# Altium project _OV2640 24-pin Pinout.PrjPCB
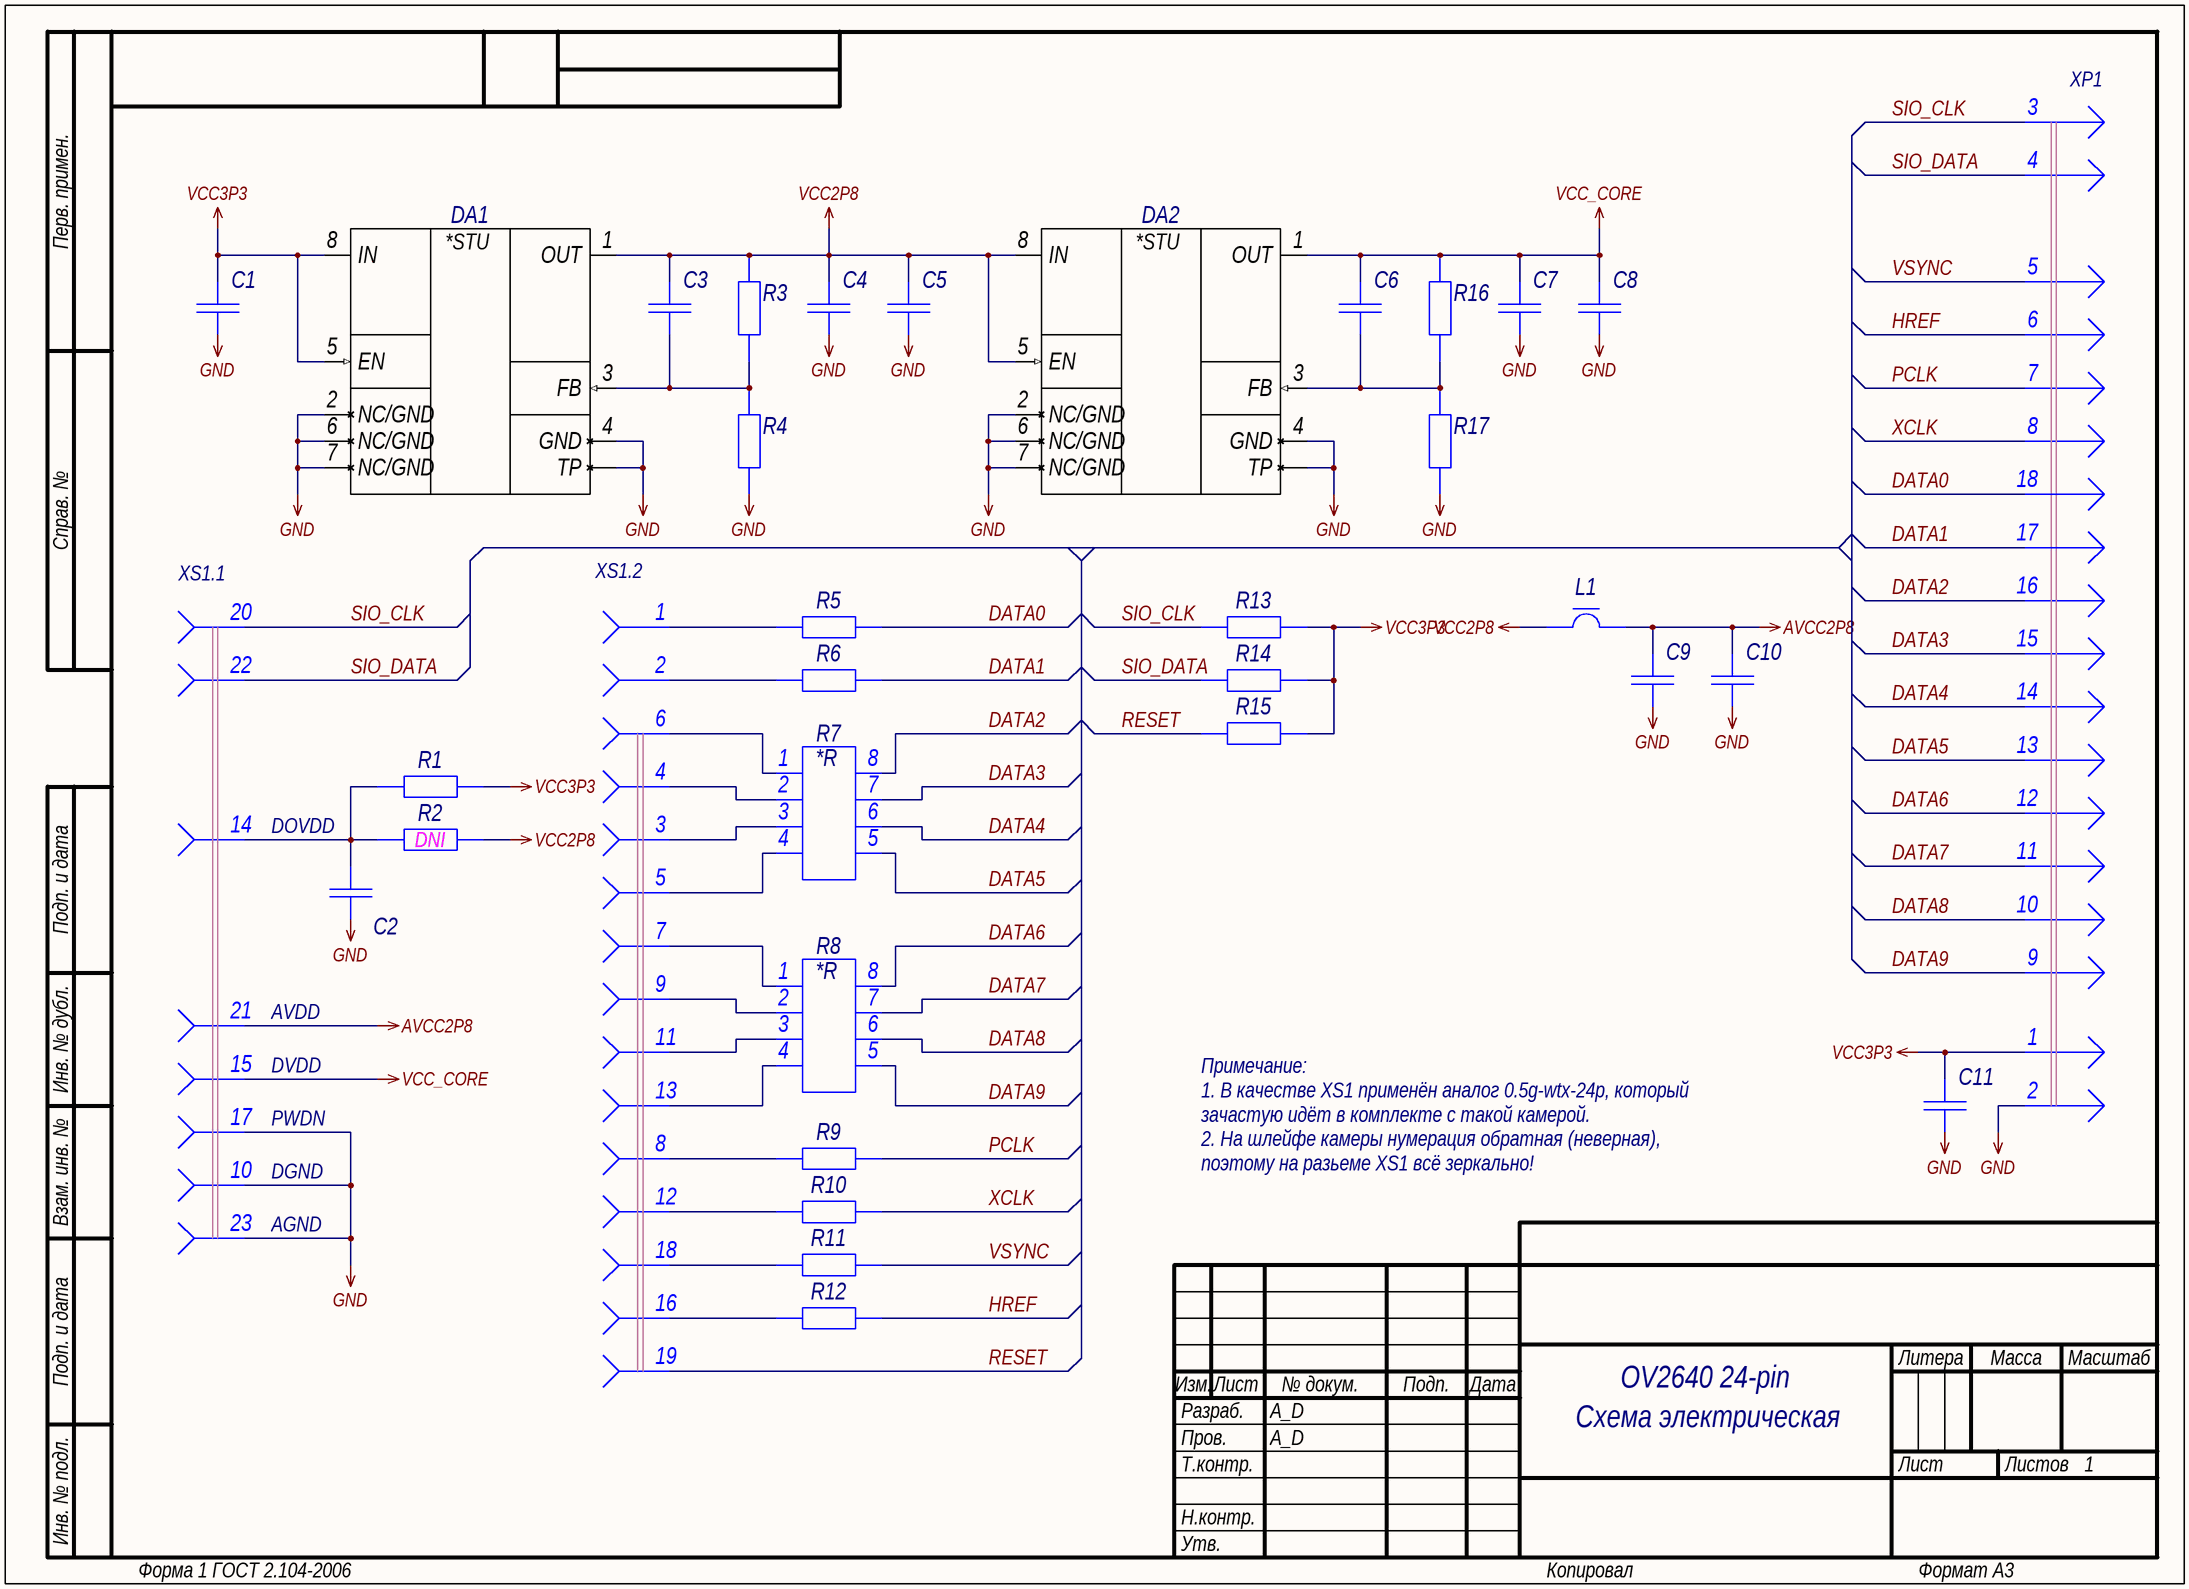
[diagram p0: 01_MAIN.SchDoc]
GlobalProjectRevision: 0; GlobalProjectNumber: A_D.000000.001; GlobalProjectName: OV2640 24-pin; GlobalOrganizationName: A_D Electronics
1 sheet, 33 parts. Net scope: global (net labels, ports and power ports of the same name join across sheets).
Board file: BOARD.PcbDoc

## Sheet 01_MAIN.SchDoc: =GlobalProjectName
size 410 x 297 mm; CheckedBy: A_D; Author: A_D; Organization: A_D Electronics; DocumentNumber: A_D.000000.001 Э3; Revision: 0; SheetTotal: 1; PageSetup: Record=PageOptions|CenterHorizontal=True|CenterVertical=True|PrintScale=0.70|XCorrection=1.00|YCorrection=1.00|PrintKind=2|BorderSize=5000000|LeftOffset=9000|BottomOffset=10100|Orientation=2|PaperLength=11176|PaperWidth=8636|Scale=100|PaperSource=259|PrintQuality=-3|MediaType=1|DitherType=10|PrintScaleMode=1|PaperKind=A3|PaperIndex=8; FirstApplication: A_D.000000.001; DocumentName: OV2640 24-pin

### Parts
C1  Capacitor  [C0603_160X080H080_H]  (value not drawn)
C2  Capacitor  [C0603_160X080H080_H]  (value not drawn)
C3  Capacitor  [C0603_160X080H080_H]  (value not drawn)
C4  Capacitor  [C0603_160X080H080_H]  (value not drawn)
C5  Capacitor  [C0603_160X080H080_H]  (value not drawn)
C6  Capacitor  [C0603_160X080H080_H]  (value not drawn)
C7  Capacitor  [C0603_160X080H080_H]  (value not drawn)
C8  Capacitor  [C0603_160X080H080_H]  (value not drawn)
C9  Capacitor  [C0603_160X080H080_H]  (value not drawn)
C10  Capacitor  [C0603_160X080H080_H]  (value not drawn)
C11  Capacitor  [C0603_160X080H080_H]  (value not drawn)
DA1  TPS73501DRB  [VSON-8_065P300X300X100_N]  (value not drawn)
DA2  TPS73501DRB  [VSON-8_065P300X300X100_N]  (value not drawn)
L1  FerriteBead  [L0603_160X080H080_H]  (value not drawn)
R1  Resistor  [R0603_160X080H045_H]  (value not drawn)
R2  Resistor  [R0603_160X080H045_H]  (value not drawn)  (no BOM)
R3  Resistor  [R0603_160X080H045_H]  (value not drawn)
R4  Resistor  [R0603_160X080H045_H]  (value not drawn)
R5  Resistor  [R0603_160X080H045_H]  (value not drawn)
R6  Resistor  [R0603_160X080H045_H]  (value not drawn)
R7  Resistor-4  [CAT16-x4]  (value not drawn)
R8  Resistor-4  [CAT16-x4]  (value not drawn)
R9  Resistor  [R0603_160X080H045_H]  (value not drawn)
R10  Resistor  [R0603_160X080H045_H]  (value not drawn)
R11  Resistor  [R0603_160X080H045_H]  (value not drawn)
R12  Resistor  [R0603_160X080H045_H]  (value not drawn)
R13  Resistor  [R0603_160X080H045_H]  (value not drawn)
R14  Resistor  [R0603_160X080H045_H]  (value not drawn)
R15  Resistor  [R0603_160X080H045_H]  (value not drawn)
R16  Resistor  [R0603_160X080H045_H]  (value not drawn)
R17  Resistor  [R0603_160X080H045_H]  (value not drawn)
XP1  Text  [PLD-18]  (value not drawn)  (parts A,B,C,D,E,F,G,H,I,J,K,L,M,N,O,P,Q,R of 18)
XS1  OV7670  [FH12-24S-0.5SH]  (value not drawn)  (parts A,B,C,D,E,F,G,H,I,J,K,L,M,N,O,P,Q,R,S,T,U,V,W of 24)

### Nets
AVCC2P8: C9.2 C10.2 L1.2 XS1.21
GND: C1.1 C2.1 C4.1 C5.1 C7.1 C8.1 C9.1 C10.1 C11.1 DA1.2(NC/GND) DA1.4(GND) DA1.6(NC/GND) DA1.7(NC/GND) DA1.TP DA2.2(NC/GND) DA2.4(GND) DA2.6(NC/GND) DA2.7(NC/GND) DA2.TP R4.1 R17.1 XP1.2 XS1.10 XS1.17 XS1.23
VCC2P8: C3.2 C4.2 C5.2 DA1.1(OUT) DA2.5(EN) DA2.8(IN) L1.1 R2.2 R3.1
VCC3P3: C1.2 C11.2 DA1.5(EN) DA1.8(IN) R1.2 R13.2 R14.2 R15.2 XP1.1
VCC_CORE: C6.2 C7.2 C8.2 DA2.1(OUT) R16.2 XS1.15
DATA0: R5.2 XP1.18
DATA1: R6.2 XP1.17
DATA2: R7.8 XP1.16
DATA3: R7.7 XP1.15
DATA4: R7.6 XP1.14
DATA5: R7.5 XP1.13
DATA6: R8.8 XP1.12
DATA7: R8.7 XP1.11
DATA8: R8.6 XP1.10
DATA9: R8.5 XP1.9
HREF: R12.2 XP1.6
PCLK: R9.2 XP1.7
RESET: R15.1 XS1.19
SIO_CLK: R13.1 XP1.3 XS1.20
SIO_DATA: R14.1 XP1.4 XS1.22
VSYNC: R11.2 XP1.5
XCLK: R10.2 XP1.8
NetC2_2: C2.2 R1.1 R2.1 XS1.14
NetC3_1: C3.1 DA1.3(FB) R3.2 R4.2
NetC6_1: C6.1 DA2.3(FB) R16.1 R17.2
NetR5_1: R5.1 XS1.1
NetR6_1: R6.1 XS1.2
NetR7_1: R7.1 XS1.6
NetR7_2: R7.2 XS1.4
NetR7_3: R7.3 XS1.3
NetR7_4: R7.4 XS1.5
NetR8_1: R8.1 XS1.7
NetR8_2: R8.2 XS1.9
NetR8_3: R8.3 XS1.11
NetR8_4: R8.4 XS1.13
NetR9_1: R9.1 XS1.8
NetR10_1: R10.1 XS1.12
NetR11_1: R11.1 XS1.18
NetR12_1: R12.1 XS1.16

### Notes on the sheet
- (near XP1) XP1
- (near XS1) XS1.1
- (near XS1) XS1.2
- DOVDD
- (near R2) DNI
- (near XS1) AVDD
- (near XS1) PWDN
- (near XS1) DVDD
- (near XS1) DGND
- Примечание:
  1. В качестве XS1 применён аналог 0.5g-wtx-24p, который зачастую идёт в комплекте с такой камерой.
  2. На шлейфе камеры нумерация обратная (неверная), поэтому на разьеме XS1 всё зеркально!
- (near XS1) AGND
- Схема электрическая
  принципиальная
- Перв. примен.
- Справ. №
- Подп. и дата
- Инв. № дубл.
- Взам. инв. №
- Разраб.
- Изм.
- Лист
- № докум.
- Подп.
- Дата
- Литера
- Масса
- Масштаб
- Пров.
- Т.контр.
- Листов
- Инв. № подл.
- Н.контр.
- Утв.
- Форма 1 ГОСТ 2.104-2006
- Копировал
- Формат А3
- (in symbol CAT16-510J4LF) *R
- (in symbol TPS73501DRBR) *STU
- (in symbol TC164-JR-0751RL) *R

### Library data of the parts
C1 C2 C5 C9 = GCM188R71E105KA64D: Manufacturer: Murata; Type: Конденсатор; ID: 134; Value: 1uF; Voltage: 25V; Tolerance: ±10%; Dielectric Type: X7R; Application Category: 1; Working Temperature Min: -55°С; Working Temperature Max: +125°С; Functional Analog: GCM188R71E105KA64J; Schematic Value: 1uF, 25V, X7R; Published: 18.05.2010; Publisher: Andrew Danich; Part Number: GCM188R71E105KA64D; Footprint: 0603
C3 C6 = GRM1885C1H270JA01D: Manufacturer: Murata; Type: Конденсатор; ID: 213; Value: 27pF; Voltage: 50V; Tolerance: ±5%; Dielectric Type: NP0; Application Category: 1; Working Temperature Min: -55°С; Working Temperature Max: +125°С; Functional Analog: GRM1885C1H270JA01J; Schematic Value: 27pF, 50V, NP0; Published: 18.05.2010; Publisher: Andrew Danich; Part Number: GRM1885C1H270JA01D; Footprint: 0603
C4 C7 C11 = GRM188R60J106ME47D: Manufacturer: Murata; Type: Конденсатор; ID: 136; Value: 10uF; Voltage: 6.3V; Tolerance: ±20%; Dielectric Type: X5R; Application Category: 1; Working Temperature Min: -55°С; Working Temperature Max: +85°С; Functional Analog: GRM188R60J106ME47J; Schematic Value: 10uF, 6.3V, X5R; Published: 18.05.2010; Publisher: Andrew Danich; Part Number: GRM188R60J106ME47D; Footprint: 0603
C8 C10 = GRM188R72A104KA35D: Manufacturer: Murata; Type: Конденсатор; ID: 232; Value: 0.1uF; Voltage: 100V; Tolerance: ±10%; Dielectric Type: X7R; Application Category: 1; Working Temperature Min: -55°С; Working Temperature Max: +125°С; Functional Analog: GRM188R72A104KA35J; Schematic Value: 0.1uF, 100V, X7R; Published: 18.05.2010; Publisher: Andrew Danich; Part Number: GRM188R72A104KA35D; Footprint: 0603
DA1 DA2 = TPS73501DRBR: Manufacturer: Texas Instruments; ID: 27; Input Voltage: +2.2…5.5V; Output Current: 500mA; Output Voltage: +1.2…5.5V; RMS Noise: 13.2uV; Application Category: 1; Working Temperature Min: -40°С; Working Temperature Max: +125°С; Functional Analog: TPS73501DRBT; Published: 25.03.2019; Publisher: Andrew Danich; Type: Микросхема; Part Number: TPS73501DRBR; Value: TPS73501DRBR; ClassName: DirectConnect
L1 = BLM18PG221SH1D: Manufacturer: Murata; Type: Дроссель; ID: 8; Rated Current: 1.4A; Impedance at 100Mhz: 220ohm; Tolerance: ±25%; DC Resistance: 0.1ohm; Inductor Type: EMIFIL; Application Category: 1; Working Temperature Min: -55°С; Working Temperature Max: +125°С; Schematic Value: 220ohm ±25%; Functional Analog: BLM18PG221SH1B; Published: 14.11.2014; Publisher: Andrew Danich; Part Number: BLM18PG221SH1D; Value: BLM18PG221SH1D; Footprint: 0603
R1 R2 = RC0603JR-070R: Manufacturer: Yageo; ID: 5; Value: 0; Limit Voltage: 50V; Tolerance: ±5%; Temperature Coefficient: 100ppm; Total Power Dissipation: 0.1W; Series Type: Thick-Film; Application Category: 1; Working Temperature Min: -55°С; Working Temperature Max: +155°С; Functional Analog: RC0603FR-070RL, CR0603-J/-000E; Schematic Value: 0 ±5%; Published: 24.03.2010; Publisher: Andrew Danich; Type: Резистор; Part Number: RC0603JR-070R; Footprint: 0603
R3 R16 = RC0603JR-0727KL: Manufacturer: Yageo; ID: 38; Value: 27k; Limit Voltage: 50V; Tolerance: ±5%; Temperature Coefficient: 100ppm; Total Power Dissipation: 0.1W; Series Type: Thick-Film; Application Category: 1; Working Temperature Min: -55°С; Working Temperature Max: +155°С; Schematic Value: 27k ±5%; Published: 24.03.2010; Publisher: Andrew Danich; Type: Резистор; Part Number: RC0603JR-0727KL; Footprint: 0603
R4 = RC0603FR-0720KL: Manufacturer: Yageo; ID: 259; Value: 20k; Limit Voltage: 50V; Tolerance: ±1%; Temperature Coefficient: 100ppm; Total Power Dissipation: 0.1W; Series Type: Thick-Film; Application Category: 1; Working Temperature Min: -55°С; Working Temperature Max: +155°С; Schematic Value: 20k ±1%; Published: 24.03.2010; Publisher: Andrew Danich; Type: Резистор; Part Number: RC0603FR-0720KL; Footprint: 0603
R5 R6 R9-R12 = RC0603JR-0751RL: Manufacturer: Yageo; ID: 314; Value: 51; Limit Voltage: 50V; Tolerance: ±5%; Temperature Coefficient: 100ppm; Total Power Dissipation: 0.1W; Series Type: Thick-Film; Application Category: 1; Working Temperature Min: -55°С; Working Temperature Max: +155°С; Functional Analog: CR0603-JW-510E; Schematic Value: 51 ±5%; Published: 24.03.2010; Publisher: Andrew Danich; Type: Резистор; Part Number: RC0603JR-0751RL; Footprint: 0603
R7 R8 = CAT16-510J4LF: Manufacturer: Bourns; ID: 21; Value: 51; Limit Voltage: 50V; Tolerance: ±5%; Temperature Coefficient: 200ppm; Total Power Dissipation: 0,062W; Series Type: Thick-Film; Application Category: 1; Working Temperature Min: -55°С; Working Temperature Max: +125°С; Functional Analog: TC164-JR-0751RL; Schematic Value: 51 ±5%; Published: 15.07.2014; Publisher: Andrew Danich; Type: Набор резисторов; Part Number: CAT16-510J4LF
R13-R15 = RC0603JR-074K7L: Manufacturer: Yageo; ID: 56; Value: 4.7k; Limit Voltage: 50V; Tolerance: ±5%; Temperature Coefficient: 100ppm; Total Power Dissipation: 0.1W; Series Type: Thick-Film; Application Category: 1; Working Temperature Min: -55°С; Working Temperature Max: +155°С; Schematic Value: 4.7k ±5%; Published: 24.03.2010; Publisher: Andrew Danich; Type: Резистор; Part Number: RC0603JR-074K7L; Footprint: 0603
R17 = RC0603JR-07360KL: Manufacturer: Yageo; ID: 48; Value: 360k; Limit Voltage: 50V; Tolerance: ±5%; Temperature Coefficient: 100ppm; Total Power Dissipation: 0.1W; Series Type: Thick-Film; Application Category: 1; Working Temperature Min: -55°С; Working Temperature Max: +155°С; Schematic Value: 360k ±5%; Published: 24.03.2010; Publisher: Andrew Danich; Type: Резистор; Part Number: RC0603JR-07360KL; Footprint: 0603
XP1 = PLD-18: Value: PLD-18; ID: 121; Limit Voltage: 250V; Limit Current: 3A; Connector Type: Male; Resistance: 15momh; Surface Finish: Gold; Pitch: 2.54mm; Application Category: 1; Published: 03.09.2018; Publisher: Andrew Danich; Type: Вилка; Part Number: PLD-18; Pins: 18
XS1 = FH12-24S-0.5SH(55): Manufacturer: Hirose Connector; ID: 4; Limit Voltage: 50V; Limit Current: 500mA; Connector Type: Female; Pitch: 0.5mm; Application Category: 1; Published: 09.02.2019; Publisher: Andrew Danich; Type: Розетка; Part Number: FH12-24S-0.5SH(55); Value: FH12-24S-0.5SH(55); Pins: 24; Series: FFC